# Altium project TPS54360.PrjPcb
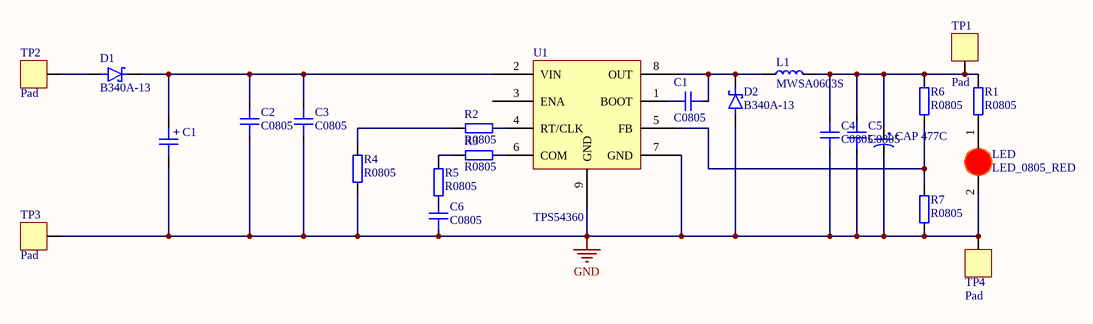
[diagram p0: Sheet1.SchDoc]
1 sheet, 24 parts. Net scope: global (net labels, ports and power ports of the same name join across sheets).
Board file: PCB1.PcbDoc

## Sheet Sheet1.SchDoc
size A; SheetNumber: 1; SheetTotal: 1

### Parts
(Parts that share a designator on the sheet are numbered #1, #2 ... from top to bottom, then left to right.)
C1#1  C0805  [CAP_0805]
C1#2  CAP_ALEL_16x16.5_25V  [CAP_ALEL_16x16.5]  (value not drawn)
C2  C0805  [CAP_0805]
C3  C0805  [CAP_0805]
C4  C0805  [CAP_0805]
C5  C0805  [CAP_0805]
C6  C0805  [CAP_0805]
D1  B340A-13  [B340A]
D2  B340A-13  [B340A]
L1  MWSA0603S  [MWSA0603S]
LED  LED_0805_RED  [LED-0805-Red]
R1  R0805  [RES_0805]
R2  R0805  [RES_0805]
R3  R0805  [RES_0805]
R4  R0805  [RES_0805]
R5  R0805  [RES_0805]
R6  R0805  [RES_0805]
R7  R0805  [RES_0805]
TP1  Pad  [PAD_SQ_2MM]  (no BOM)
TP2  Pad  [PAD_SQ_2MM]  (no BOM)
TP3  Pad  [PAD_SQ_2MM]  (no BOM)
TP4  Pad  [PAD_SQ_2MM]  (no BOM)
U1  TPS54360  [TPS5430DDAR]
  CAP 477C  [tu tantalum smd7343]

### Nets
GND: C1#2.2 C2.1 C3.1 C4.1 C5.1 C6.1 D2.A LED.2(K) R4.1 R7.1 TP3.1 TP4.1 U1.7(GND) U1.9(GND) .2
NetC1#1_1: C1#1.1 U1.1(BOOT)
NetC1#1_2: C1#1.2 D2.C L1.1 U1.8(OUT)
NetC1#2_1: C1#2.1 C2.2 C3.2 D1.C U1.2(VIN)
NetC4_2: C4.2 C5.2 L1.2 R1.2 R6.2 TP1.1 .1
NetC6_2: C6.2 R5.1
NetD1_A: D1.A TP2.1
NetLED_1: LED.1(A) R1.1
NetR2_1: R2.1 R4.2
NetR2_2: R2.2 U1.4(RT/CLK)
NetR3_1: R3.1 R5.2
NetR3_2: R3.2 U1.6(COM)
NetR6_1: R6.1 R7.2 U1.5(FB)

Not connected (* = marked no-connect by the designer): U1 3(ENA)

### Notes on the sheet
- (in symbol CAP_ALEL_16x16.5_25V) +

### Library data of the parts
C1#1 C2-C6 = CAP_0805: Capacitor SMD 0805; Manufacturer: *; Manufacturer Part Number: *; Distributor Link: *; LCSC: *; Rating: *; Dielectric: *
C1#2 = CAP_ALEL_16x16.5_25V: Capacitor SMD Aluminium Electrolytic 16x16.5mm 25V; Manufacturer: *; Manufacturer Part Number: *
D1 D2 = B340A-13: Diode Schottky 40 V 3A Surface Mount SMA; MF: Diodes Inc.; Value: *; MP: B340A-13; Package: DO-214 Diodes Inc.; Availability: In Stock; Price: None; SnapEDA_Link: https://www.snapeda.com/parts/B340A-13/Diodes+Inc./view-part/?ref=snap; Check_prices: https://www.snapeda.com/parts/B340A-13/Diodes+Inc./view-part/?ref=eda; Purchase-URL: https://pricing.snapeda.com/search/part/B340A-13/?ref=eda
L1 = MWSA0603S: Power Inductor SMD Sunlord MWSA0603S; Manufacturer Part Number: MWSA0603S-; Manufacturer: Sunlord
R1-R7 = RES_0805: Resistor SMD 0805; Manufacturer: *; Manufacturer Part Number: *; Distributor Link: *; LCSC: *
TP1-TP4 = PAD_SQ_2MM: Test Point Square 2mm
 = CAP 477C: Tụ tantalum 7343 477C 16V 470uF 7.3x4.3mm